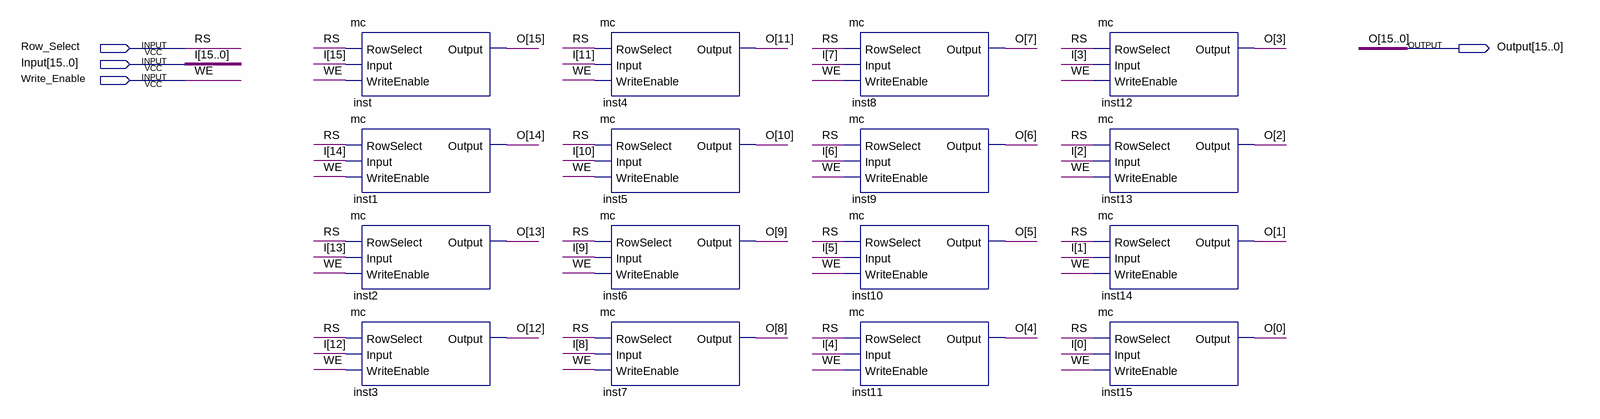
[diagram p0: schematic sheet]
// Quartus schematic 16bit.bdf as structural Verilog: 16 symbols, 4 pins
module \16bit  (
  input  Row_Select,
  input  [15:0] Input,
  input  Write_Enable,
  output [15:0] Output
);

  mc inst (.RowSelect(Row_Select), .Input(Input[15]), .WriteEnable(Write_Enable), .Output(Output[15]));
  mc inst1 (.RowSelect(Row_Select), .Input(Input[14]), .WriteEnable(Write_Enable), .Output(Output[14]));
  mc inst2 (.RowSelect(Row_Select), .Input(Input[13]), .WriteEnable(Write_Enable), .Output(Output[13]));
  mc inst3 (.RowSelect(Row_Select), .Input(Input[12]), .WriteEnable(Write_Enable), .Output(Output[12]));
  mc inst4 (.RowSelect(Row_Select), .Input(Input[11]), .WriteEnable(Write_Enable), .Output(Output[11]));
  mc inst5 (.RowSelect(Row_Select), .Input(Input[10]), .WriteEnable(Write_Enable), .Output(Output[10]));
  mc inst6 (.RowSelect(Row_Select), .Input(Input[9]), .WriteEnable(Write_Enable), .Output(Output[9]));
  mc inst7 (.RowSelect(Row_Select), .Input(Input[8]), .WriteEnable(Write_Enable), .Output(Output[8]));
  mc inst8 (.RowSelect(Row_Select), .Input(Input[7]), .WriteEnable(Write_Enable), .Output(Output[7]));
  mc inst9 (.RowSelect(Row_Select), .Input(Input[6]), .WriteEnable(Write_Enable), .Output(Output[6]));
  mc inst10 (.RowSelect(Row_Select), .Input(Input[5]), .WriteEnable(Write_Enable), .Output(Output[5]));
  mc inst11 (.RowSelect(Row_Select), .Input(Input[4]), .WriteEnable(Write_Enable), .Output(Output[4]));
  mc inst12 (.RowSelect(Row_Select), .Input(Input[3]), .WriteEnable(Write_Enable), .Output(Output[3]));
  mc inst13 (.RowSelect(Row_Select), .Input(Input[2]), .WriteEnable(Write_Enable), .Output(Output[2]));
  mc inst14 (.RowSelect(Row_Select), .Input(Input[1]), .WriteEnable(Write_Enable), .Output(Output[1]));
  mc inst15 (.RowSelect(Row_Select), .Input(Input[0]), .WriteEnable(Write_Enable), .Output(Output[0]));

  // Other names for the same wires on the sheet: I[15:0] = Input; O[15:0] = Output; RS = Row_Select;
  //   WE = Write_Enable
endmodule
